# Altium schematic sheet Gecko.SchDoc: Blue Gecko and Sensor
size A4; Organization: Energy Auditor; Address1: Sensor Node; Address3: University of Colorado; Address4: Boulder; DocumentNumber: 4; Revision: 1; SheetNumber: 4; SheetTotal: 6
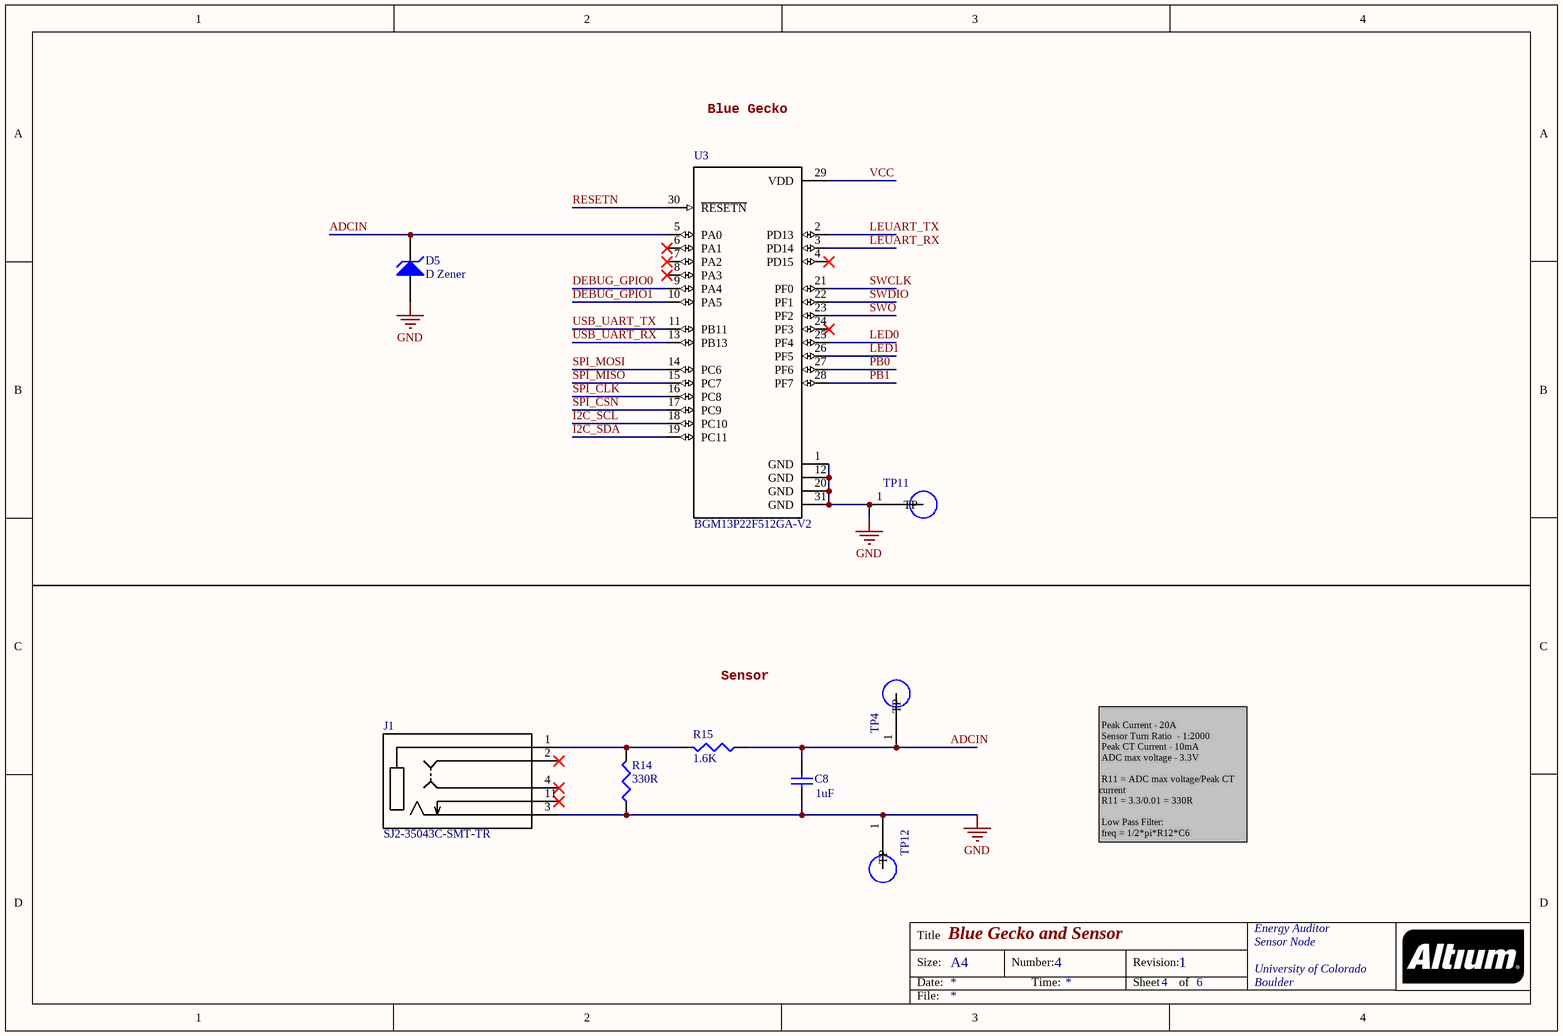
[diagram p0: Gecko.SchDoc]

## Parts
C8  1uF  [1608[0603]]
D5  D Zener  [0402]
J1  SJ2-35043C-SMT-TR  [CUI_SJ2-35043C-SMT-TR]
R14  value 330R  [1608[0603]]  (hidden comment: 330)
R15  1.6K  [1608[0603]]
TP4  5019  [TP380X203]  (value not drawn)
TP11  5019  [TP380X203]  (value not drawn)
TP12  5019  [TP380X203]  (value not drawn)
U3  BGM13P22F512GA-V2  [MODULE_BGM13P22F512GA-V2]

## Nets
GND: C8.1 D5.1(A) J1.3(RING) R14.1 TP11.1(TP) TP12.1(TP) U3.1(GND) U3.12(GND) U3.20(GND) U3.31(GND)
ADCIN: C8.2 D5.2(K) R15.1 TP4.1(TP) U3.5(PA0)
DEBUG_GPIO0: U3.9(PA4)
DEBUG_GPIO1: U3.10(PA5)
I2C_SCL: U3.18(PC10)
I2C_SDA: U3.19(PC11)
LED0: U3.25(PF4)
LED1: U3.26(PF5)
LEUART_RX: U3.3(PD14)
LEUART_TX: U3.2(PD13)
PB0: U3.27(PF6)
PB1: U3.28(PF7)
RESETN: U3.30(~{RESETN})
SPI_CLK: U3.16(PC8)
SPI_CSN: U3.17(PC9)
SPI_MISO: U3.15(PC7)
SPI_MOSI: U3.14(PC6)
SWCLK: U3.21(PF0)
SWDIO: U3.22(PF1)
SWO: U3.23(PF2)
USB_UART_RX: U3.13(PB13)
USB_UART_TX: U3.11(PB11)
VCC: U3.29(VDD)
NetJ1_1: J1.1(SLEEVE) R14.2 R15.2

Not connected (* = marked no-connect by the designer): J1 2(TIP_1)* 4(TIP_2)* 11(RING_SWITCH)*; U3 4(PD15)* 6(PA1)* 7(PA2)* 8(PA3)* 24(PF3)*

## Notes on the sheet
- Blue Gecko
- Sensor
- Peak Current - 20A
  Sensor Turn Ratio  - 1:2000
  Peak CT Current - 10mA
  ADC max voltage - 3.3V
  R11 = ADC max voltage/Peak CT current
  R11 = 3.3/0.01 = 330R
  Low Pass Filter:
  freq = 1/2*pi*R12*C6
  freq = 312 Hz
- Title
- Size:
- Date:
- A4
- Number:
- Time:
- Revision:
- Sheet
- of
- File:

## Library data of the parts
C8 = Cap: CAP CER 1UF 16V X7R 0603; Manufacturer: Samsung Electro-Mechanics; Manufacturer Part Number: CL10B105MO8NNWC; Value: 1uF; Digi-Key Part Number: 1276-6524-1-ND; ComponentLink1URL: https://www.digikey.com/product-detail/en/samsung-electro-mechanics/CL10B105MO8NNWC/1276-6524-1-ND/5961383; ComponentLink1Description: Digi-Key Link
D5 = D Zener: Zener Diode; Manufacturer Part Number: TPD1E10B06DPYR; Manufacturer: Texas Instruments; ComponentLink1URL: https://www.digikey.com/product-detail/en/texas-instruments/TPD1E10B06DPYR/296-30406-1-ND/3283560; ComponentLink1Description: Digi-Key Link; Value: *; Digi-Key Part Number: 296-30406-1-ND
J1 = SJ2-35043C-SMT-TR: AUDIO JACK, 3.5 MM, RT, 4 CONDUC; Manufacturer: CUI Inc.; Value: *; Digi-Key Part Number: CP-SJ2-35043C-SMT-CT-ND; Manufacturer Part Number: SJ2-35043C-SMT-TR; ComponentLink1URL: https://www.digikey.com/products/en/connectors-interconnects/barrel-audio-connectors/434?k=SJ2-35043C-SMT-TR&k=&pkeyword=SJ2-35043C-SMT-TR&pv7=2&sf=0&quantity=&ColumnSort=0&page=1&pageSize=25; ComponentLink1Description: Digi-Key Link
R14 = Res3: RES SMD 330 OHM 5% 1/10W 0603; Manufacturer: Vishay Dale; Manufacturer Part Number: CRCW0603330RJNEAC; Digi-Key Part Number: 541-4060-1-ND; ComponentLink1URL: https://www.digikey.com/product-detail/en/vishay-dale/CRCW0603330RJNEAC/541-4060-1-ND/7928743; ComponentLink1Description: Digi-Key Link
R15 = Res3: RES SMD 1.6K OHM 5% 1/10W 0603; Manufacturer: Yageo; Manufacturer Part Number: RC0603JR-071K6L; Value: 1.6K; Digi-Key Part Number: 311-1.6KGRCT-ND; ComponentLink1URL: https://www.digikey.com/product-detail/en/yageo/RC0603JR-071K6L/311-1.6KGRCT-ND/729639; ComponentLink1Description: Digi-Key Link
TP4 TP11 TP12 = 5019: Phosphor Bronze Contact Miniature Silver Plated Surface Mount Test Points; Manufacturer: Keystone; Manufacturer Part Number: 5019; Digi-Key Part Number: 36-5019CT-ND; ComponentLink1URL: https://www.digikey.com/product-detail/en/keystone-electronics/5019/36-5019CT-ND/3907344?utm_source=snapeda&utm_medium=aggregator&utm_campaign=symbol; Value: *; ComponentLink1Description: Digi-Key Link
U3 = BGM13P22F512GA-V2: BLUETOOTH 5.0 MODULE; Manufacturer: Silicon Labs; Manufacturer Part Number: BGM13P22F512GA-V2; Value: *; ComponentLink1URL: https://www.digikey.com/products/en/rf-if-and-rfid/rf-transceiver-modules/872?k=BGM13P22F512GA-V2&k=&pkeyword=BGM13P22F512GA-V2&pv7=2&sf=0&quantity=&ColumnSort=0&page=1&pageSize=25; ComponentLink1Description: Digi-Key Link; Digi-Key Part Number: 336-5146-1-ND